# Altium schematic sheet 3_SDRAM.SchDoc
size A4; SheetNumber: 3; SheetTotal: 4
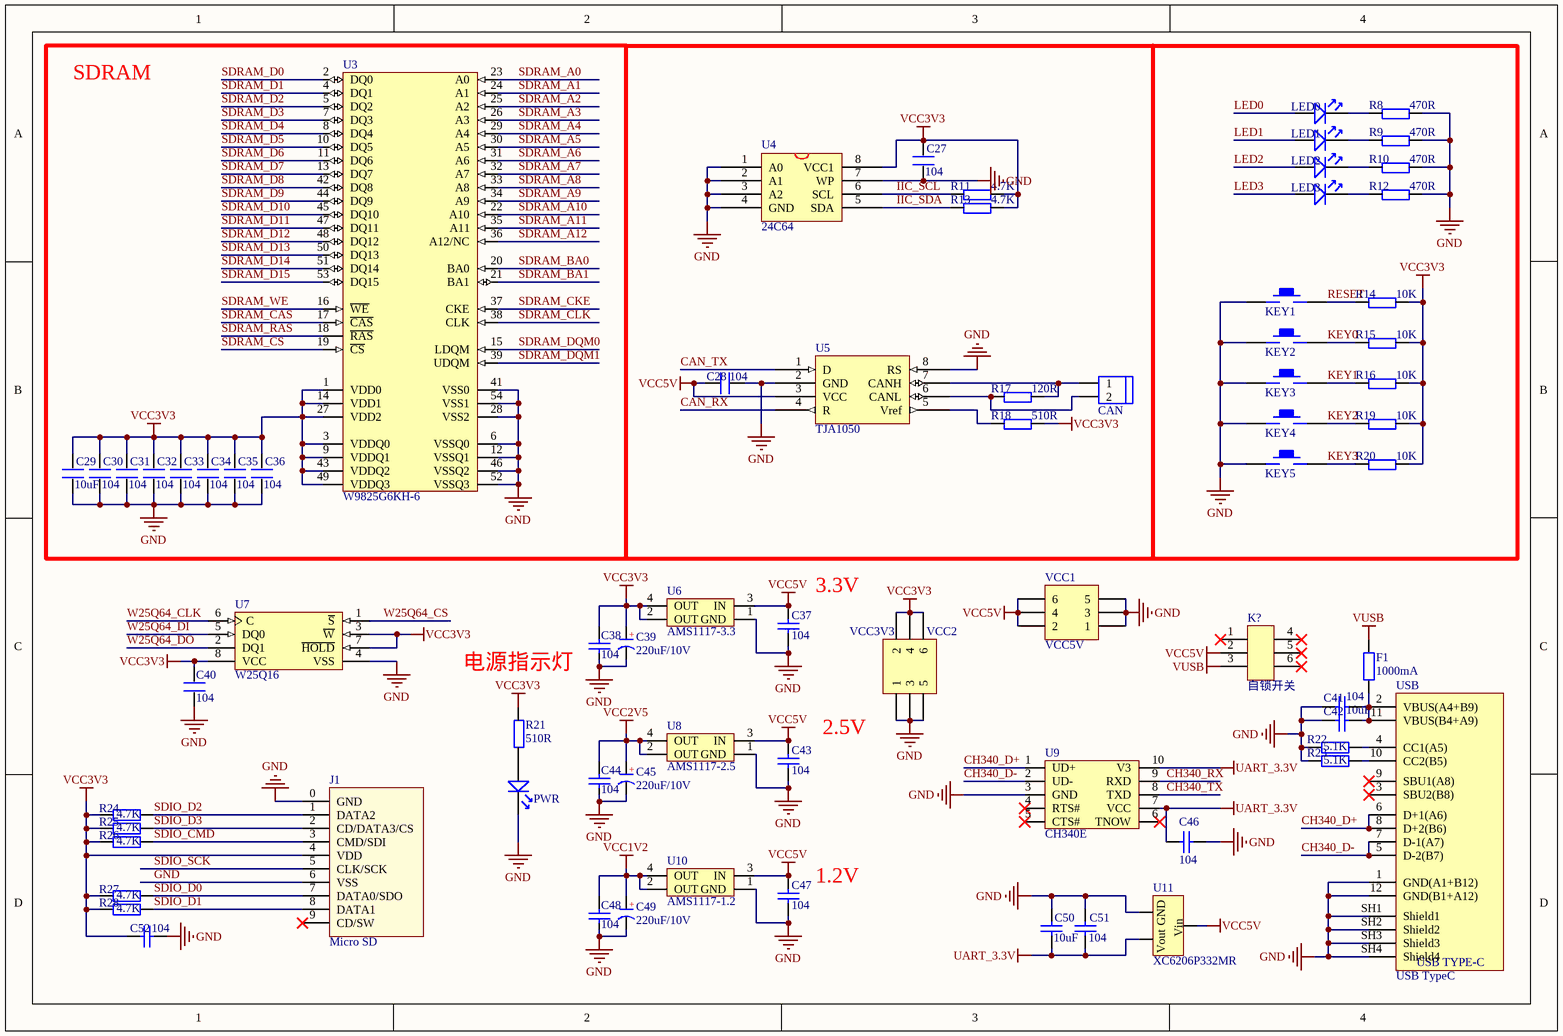
[diagram p0: 3_SDRAM.SchDoc]

## Parts
C27  104  [C 0603]
C28  104  [C 0603]
C29  10uF  [C 0402]
C30  104  [C 0402]
C31  104  [C 0402]
C32  104  [C 0402]
C33  104  [C 0402]
C34  104  [C 0402]
C35  104  [C 0402]
C36  104  [C 0402]
C37  104  [C 0603]
C38  104  [C 0603]
C39  220uF/10V  [CD 6.3*5.4 S]
C40  104  [C 0603]
C41  104  [C 0603]
C42  10uF  [C 0603]
C43  104  [C 0603]
C44  104  [C 0603]
C45  220uF/10V  [CD 6.3*5.4 S]
C46  104  [C 0603]
C47  104  [C 0603]
C48  104  [C 0603]
C49  220uF/10V  [CD 6.3*5.4 S]
C50  10uF  [C 0603]
C51  104  [C 0603]
C52  104  [C 0603]
CAN?  CAN  [HEAD2L-0.8]
F1  1000mA  [R 0603]
J1  Micro SD  [SD-MICRO-TF]
K?  自锁开关  [自锁开关]
KEY1  KEY_M  [KEY 3.2*4.2*2.5 4P SMD - SCH 2pin]  (value not drawn)
KEY2  KEY_M  [KEY 3.2*4.2*2.5 4P SMD - SCH 2pin]  (value not drawn)
KEY3  KEY_M  [KEY 3.2*4.2*2.5 4P SMD - SCH 2pin]  (value not drawn)
KEY4  KEY_M  [KEY 3.2*4.2*2.5 4P SMD - SCH 2pin]  (value not drawn)
KEY5  KEY_M  [KEY 3.2*4.2*2.5 4P SMD - SCH 2pin]  (value not drawn)
LED1  LED0  [LED 0603 Red]
LED2  LED1  [LED 0603 Red]
LED3  LED2  [LED 0603 Red]
LED4  LED3  [LED 0603 Red]
LED5  PWR  [LED 0603 Red]
R8  470R  [R 0603]
R9  470R  [R 0603]
R10  470R  [R 0603]
R11  4.7K  [R 0603]
R12  470R  [R 0603]
R13  4.7K  [R 0603]
R14  10K  [R 0603]
R15  10K  [R 0603]
R16  10K  [R 0603]
R17  120R  [R 0603]
R18  510R  [R 0603]
R19  10K  [R 0603]
R20  10K  [R 0603]
R21  510R  [R 0603]
R22  5.1K  [R 0603]
R23  5.1K  [R 0603]
R24  4.7K  [R 0603]
R25  4.7K  [R 0603]
R26  4.7K  [R 0603]
R27  4.7K  [R 0603]
R28  4.7K  [R 0603]
U3  W9825G6KH-6  [TSOP54]
U4  24C64  [SOP-8]
U5  TJA1050  [SOP-8]
U6  AMS1117-3.3  [AMS1117]
U7  W25Q16  [SOIC-8_L5.3-W5.3-P1.27-LS8.0-BL]
U8  AMS1117-2.5  [AMS1117]
U9  CH340E  [MSOP10_L]
U10  AMS1117-1.2  [AMS1117]
U11  XC6206P332MR  [SOT23-3N]
USB  USB TypeC  [USB2.0-TYPE-C-16P]
VCC1  VCC5V  [HDR2X3]
VCC2  VCC3V3  [HDR2X3]

## Blocks framed on the sheet
SDRAM: C29-C36 U3

## Nets
GND: C27.1 C28.1 C29.1 C30.1 C31.1 C32.1 C33.1 C34.1 C35.1 C36.1 C37.2 C38.2 C39.2(K) C40.2 C41.2 C42.2 C43.2 C44.2 C45.2(K) C46.1 C47.2 C48.2 C49.2(K) C50.1 C51.1 C52.2 J1.0(GND) J1.6(VSS) KEY1.1 KEY2.1 KEY3.1 KEY4.1 KEY5.1 LED5.2 R8.2 R9.2 R10.2 R12.2 R22.2 R23.2 U3.6(VSSQ0) U3.12(VSSQ1) U3.28(VSS2) U3.41(VSS0) U3.46(VSSQ2) U3.52(VSSQ3) U3.54(VSS1) U4.1(A0) U4.2(A1) U4.3(A2) U4.4(GND) U4.7(WP) U5.2(GND) U5.8(RS) U6.1(GND) U7.4(VSS) U8.1(GND) U9.3(GND) U10.1(GND) U11.1(GND) USB.1(GND(A1+B12)) USB.12(GND(B1+A12)) USB.SH1(Shield1) USB.SH2(Shield2) USB.SH3(Shield3) USB.SH4(Shield4) VCC1.1 VCC1.3 VCC1.5 VCC2.1 VCC2.3 VCC2.5
UART_3.3V: C46.2 C50.2 C51.2 U9.7(VCC) U9.10(V3) U11.2(Vout)
VCC1V2: C48.1 C49.1(A) U10.2(OUT) U10.4(OUT)
VCC2V5: C44.1 C45.1(A) U8.2(OUT) U8.4(OUT)
VCC3V3: C27.2 C29.2 C30.2 C31.2 C32.2 C33.2 C34.2 C35.2 C36.2 C38.1 C39.1(A) C40.1 C52.1 J1.4(VDD) R11.2 R13.2 R14.2 R15.2 R16.2 R18.2 R19.2 R20.2 R21.2 R24.2 R25.2 R26.2 R27.2 R28.2 U3.1(VDD0) U3.3(VDDQ0) U3.9(VDDQ1) U3.14(VDD1) U3.27(VDD2) U3.43(VDDQ2) U3.49(VDDQ3) U4.8(VCC1) U6.2(OUT) U6.4(OUT) U7.3(~{W}) U7.7(~{HOLD}) U7.8(VCC) VCC2.2 VCC2.4 VCC2.6
VCC5V: C28.2 C37.1 C43.1 C47.1 K?.2 U5.3(VCC) U6.3(IN) U8.3(IN) U10.3(IN) U11.3(Vin) VCC1.2 VCC1.4 VCC1.6
VUSB: F1.2 K?.3
CAN_RX: U5.4(R)
CAN_TX: U5.1(D)
CH340_D+: U9.1(UD+) USB.6(D+1(A6)) USB.8(D+2(B6))
CH340_D-: U9.2(UD-) USB.5(D-2(B7)) USB.7(D-1(A7))
CH340_RX: U9.9(RXD)
CH340_TX: U9.8(TXD)
IIC_SCL: R11.1 U4.6(SCL)
IIC_SDA: R13.1 U4.5(SDA)
KEY0: KEY2.2 R15.1
KEY1: KEY3.2 R16.1
KEY2: KEY4.2 R19.1
KEY3: KEY5.2 R20.1
LED0: LED1.1
LED1: LED2.1
LED2: LED3.1
LED3: LED4.1
RESET: KEY1.2 R14.1
SDIO_CMD: J1.3(CMD/SDI) R26.1
SDIO_D0: J1.7(DATA0/SDO) R27.1
SDIO_D1: J1.8(DATA1) R28.1
SDIO_D2: J1.1(DATA2) R24.1
SDIO_D3: J1.2(CD/DATA3/CS) R25.1
SDIO_SCK: J1.5(CLK/SCK)
SDRAM_A0: U3.23(A0)
SDRAM_A1: U3.24(A1)
SDRAM_A2: U3.25(A2)
SDRAM_A3: U3.26(A3)
SDRAM_A4: U3.29(A4)
SDRAM_A5: U3.30(A5)
SDRAM_A6: U3.31(A6)
SDRAM_A7: U3.32(A7)
SDRAM_A8: U3.33(A8)
SDRAM_A9: U3.34(A9)
SDRAM_A10: U3.22(A10)
SDRAM_A11: U3.35(A11)
SDRAM_A12: U3.36(A12/NC)
SDRAM_BA0: U3.20(BA0)
SDRAM_BA1: U3.21(BA1)
SDRAM_CAS: U3.17(~{CAS})
SDRAM_CKE: U3.37(CKE)
SDRAM_CLK: U3.38(CLK)
SDRAM_CS: U3.19(~{CS})
SDRAM_D0: U3.2(DQ0)
SDRAM_D1: U3.4(DQ1)
SDRAM_D2: U3.5(DQ2)
SDRAM_D3: U3.7(DQ3)
SDRAM_D4: U3.8(DQ4)
SDRAM_D5: U3.10(DQ5)
SDRAM_D6: U3.11(DQ6)
SDRAM_D7: U3.13(DQ7)
SDRAM_D8: U3.42(DQ8)
SDRAM_D9: U3.44(DQ9)
SDRAM_D10: U3.45(DQ10)
SDRAM_D11: U3.47(DQ11)
SDRAM_D12: U3.48(DQ12)
SDRAM_D13: U3.50(DQ13)
SDRAM_D14: U3.51(DQ14)
SDRAM_D15: U3.53(DQ15)
SDRAM_DQM0: U3.15(LDQM)
SDRAM_DQM1: U3.39(UDQM)
SDRAM_RAS: U3.18(~{RAS})
SDRAM_WE: U3.16(~{WE})
W25Q64_CLK: U7.6(C)
W25Q64_CS: U7.1(~{S})
W25Q64_DI: U7.5(DQ0)
W25Q64_DO: U7.2(DQ1)
NetC41_1: C41.1 C42.1 F1.1 USB.2(VBUS(A4+B9)) USB.11(VBUS(B4+A9))
NetCAN?_1: CAN?.1 R17.2 U5.7(CANH)
NetCAN?_2: CAN?.2 R17.1 U5.6(CANL)
NetLED1_2: LED1.2 R8.1
NetLED2_2: LED2.2 R9.1
NetLED3_2: LED3.2 R10.1
NetLED4_2: LED4.2 R12.1
NetLED5_1: LED5.1 R21.1
NetR18_1: R18.1 U5.5(Vref)
NetR22_1: R22.1 USB.4(CC1(A5))
NetR23_1: R23.1 USB.10(CC2(B5))

Not connected (* = marked no-connect by the designer): J1 9(CD/SW)*; K? 1* 4* 5* 6*; U9 4(RTS#)* 5(CTS#)* 6(TNOW)*; USB 3(SBU2(B8))* 9(SBU1(A8))*

## Notes on the sheet
- (near C37) 3.3V
- (near R21) 电源指示灯
- 2.5V
- (near C47) 1.2V
- (in symbol C-CAP) +
- (in symbol USB Type-C) USB TYPE-C

## Library data of the parts
C27-C36 C40 = C
C37 C38 C41-C44 C46-C48 C50-C52 = C-0603-SMD
C39 C45 C49 = C-CAP: 有极性电容; 版权归属: 正点原子; 学习资源: www.openedv.com; BOM名称: 有极性电容
CAN? = HEAD2
F1 R22-R28 = R: 电阻; BOM名称: 贴片电阻; 版权归属: 正点原子; 学习资源: www.openedv.com; Parameter: 电阻
J1 = Micro SD: Micro SD卡; 版权归属: 源创客; BOM名称: Micro SD卡; 学习资源: www.ooocke.com
LED1-LED5 = LED
R8-R21 = R
U3 = IS42S16160B: 32MB SDRAM
U4 = 24C256
U5 = SN65HVD230D
U6 U8 U10 = AMS1117
U7 = M25P16: 16 Mb (x1) Automotive Serial NOR Flash Memory, 75 MHz, 2.7 to 3.6 V, 8-pin SO8; Part Family: M25P爭ISHIDDEN=T|; Manufacturer: Micron; PartNumber: M25P16-VMN3PB; Density: 16Mb爭ISHIDDEN=T|; Speed: 75 MHz爭ISHIDDEN=T|; Voltage: 2.7V-3.6V爭ISHIDDEN=T|; DatasheetVersion: Rev. Y; PackageVersion: Rev 11; PackageReference: MICT-MN-8; PackageDescription: 8-Pin SO Narrow, 3.9 X 4.9 mm, Pitch 1.27 mm; Applications: Automotive爭ISHIDDEN=T|; Package: SO8 Narrow爭ISHIDDEN=T|; Part Status: Production爭ISHIDDEN=T|; RoHS: Yes爭ISHIDDEN=T|; Type: Data Storage爭ISHIDDEN=T|; Width: x1爭ISHIDDEN=T|; Mounting Technology: Surface Mount; ComponentLink1Description: Manufacturer URL; ComponentLink1URL: http://www.micron.com/; ComponentLink2Description: Datasheet; ComponentLink2URL: http://www.micron.com/~/media/Documents/Products/Data%20Sheet/NOR%20Flash/Serial%20NOR/M25P/M25P16.pdf; ComponentLink3Description: Package Specification; ComponentLink3URL: http://www.micron.com/~/media/Documents/Products/Data%20Sheet/NOR%20Flash/Serial%20NOR/M25P/M25P05A.pdf
U9 = CH340E: USB转串口; BOM名称: 串口转USB; 版权归属: 正点原子; Parameter: 芯片; 学习资源: www.openedv.com
U11 = LDO XC6206: LDO; ComponentLink1Description: 供应商链接; ComponentLink1URL: http://www.szlcsc.com/product/details_5896.html; Package: SOT-23; Supplier: LC; SuppliersPartNumber: C5446
USB = USB Type-C: 12P TypeC 母座
VCC1 VCC2 = Header 3X2: Header, 3-Pin, Dual row; LatestRevisionDate: 17-Jul-2002; LatestRevisionNote: Re-released for DXP Platform.; Publisher: Altium Limited